# Altium project arm-radio.PrjPCB
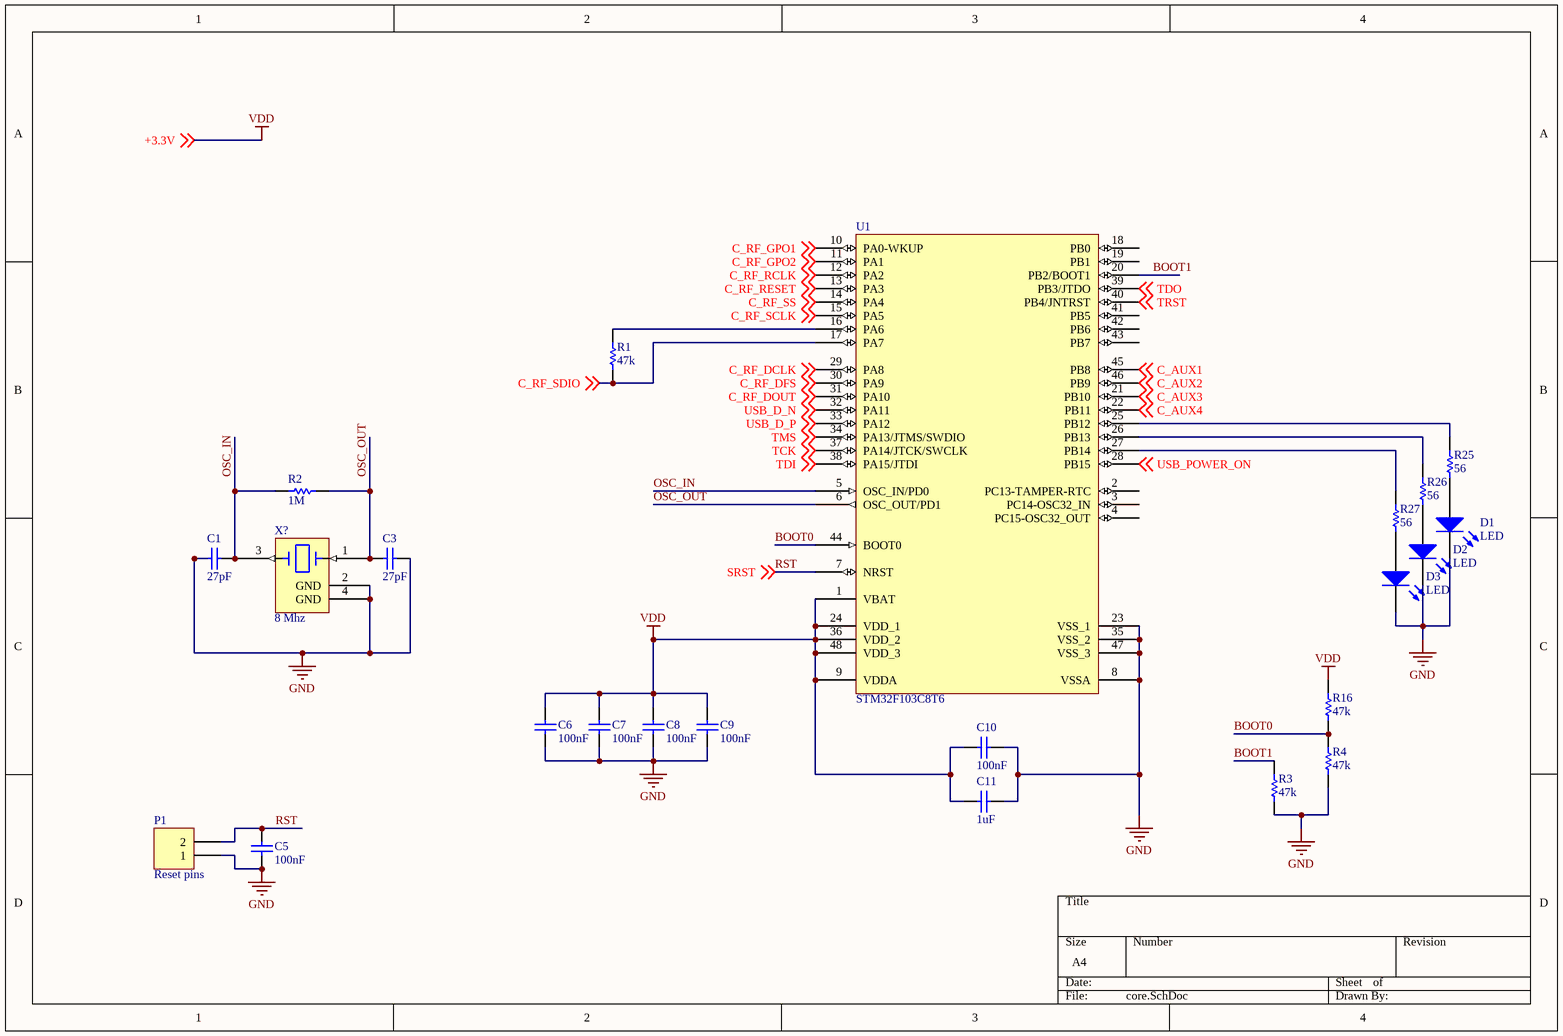
[diagram p0: core.SchDoc]
4 sheets, 54 parts. Net scope: global (net labels, ports and power ports of the same name join across sheets).
Board files: dummy.PcbDoc, dummy_planes.PcbDoc, dummy_planes_prod.PcbDoc, radio_v1.PcbDoc
Sheets:
  core.SchDoc
  usb_connector.SchDoc
  jtag_connector.SchDoc
  hole_field_direct.SchDoc

## Sheet core.SchDoc
size A4

### Parts
C1  27pF  [CHIP0402]
C3  27pF  [CHIP0402]
C5  100nF  [CHIP0402]
C6  100nF  [CHIP0402]
C7  100nF  [CHIP0402]
C8  100nF  [CHIP0402]
C9  100nF  [CHIP0402]
C10  100nF  [CHIP0402]
C11  1uF  [CHIP0402]
D1  LED  [LEDC2015X11L]
D2  LED  [LEDC2015X11L]
D3  LED  [LEDC2015X11L]
P1  Reset pins  [MHDR1X2]
R1  47k  [CHIP0402]
R2  1M  [CHIP0402]
R3  47k  [CHIP0402]
R4  47k  [CHIP0402]
R16  47k  [CHIP0402]
R25  56  [CHIP0402]
R26  56  [CHIP0402]
R27  56  [CHIP0402]
U1  STM32F103C8T6  [LQFP48_N]
X?  8 Mhz  [SMD0635x11mm]

### Nets
GND: C1.2 C3.1 C5.1 C6.1 C7.1 C8.1 C9.1 C10.2 C11.2 D1.2(K) D2.2(K) D3.2(K) P1.1 R3.1 R4.1 U1.8(VSSA) U1.23(VSS_1) U1.35(VSS_2) U1.47(VSS_3) X?.2(GND) X?.4(GND)
VDD: C6.2 C7.2 C8.2 C9.2 C10.1 C11.1 R16.2 U1.1(VBAT) U1.9(VDDA) U1.24(VDD_1) U1.36(VDD_2) U1.48(VDD_3) ; off-sheet +3.3V  [also labelled +3.3V]
BOOT0: R4.2 R16.1 U1.44(BOOT0)
BOOT1: R3.2 U1.20(PB2/BOOT1)
C_AUX1: U1.45(PB8) ; off-sheet C_AUX1
C_AUX2: U1.46(PB9) ; off-sheet C_AUX2
C_AUX3: U1.21(PB10) ; off-sheet C_AUX3
C_AUX4: U1.22(PB11) ; off-sheet C_AUX4
C_RF_DCLK: U1.29(PA8) ; off-sheet C_RF_DCLK
C_RF_DFS: U1.30(PA9) ; off-sheet C_RF_DFS
C_RF_DOUT: U1.31(PA10) ; off-sheet C_RF_DOUT
C_RF_GPO1: U1.10(PA0-WKUP) ; off-sheet C_RF_GPO1
C_RF_GPO2: U1.11(PA1) ; off-sheet C_RF_GPO2
C_RF_RCLK: U1.12(PA2) ; off-sheet C_RF_RCLK
C_RF_RESET: U1.13(PA3) ; off-sheet C_RF_RESET
C_RF_SCLK: U1.15(PA5) ; off-sheet C_RF_SCLK
C_RF_SDIO: R1.2 U1.17(PA7) ; off-sheet C_RF_SDIO
C_RF_SS: U1.14(PA4) ; off-sheet C_RF_SS
OSC_IN: C1.1 R2.2 U1.5(OSC_IN/PD0) X?.3
OSC_OUT: C3.2 R2.1 U1.6(OSC_OUT/PD1) X?.1
RST: C5.2 P1.2 U1.7(NRST) ; off-sheet SRST  [also labelled SRST]
TCK: U1.37(PA14/JTCK/SWCLK) ; off-sheet TCK
TDI: U1.38(PA15/JTDI) ; off-sheet TDI
TDO: U1.39(PB3/JTDO) ; off-sheet TDO
TMS: U1.34(PA13/JTMS/SWDIO) ; off-sheet TMS
TRST: U1.40(PB4/JNTRST) ; off-sheet TRST
USB_D_N: U1.32(PA11) ; off-sheet USB_D_N
USB_D_P: U1.33(PA12) ; off-sheet USB_D_P
USB_POWER_ON: U1.28(PB15) ; off-sheet USB_POWER_ON
NetD1_1: D1.1(A) R25.2
NetD2_1: D2.1(A) R26.1
NetD3_1: D3.1(A) R27.1
NetR1_1: R1.1 U1.16(PA6)
NetR25_1: R25.1 U1.25(PB12)
NetR26_2: R26.2 U1.26(PB13)
NetR27_2: R27.2 U1.27(PB14)

Not connected (* = marked no-connect by the designer): U1 2(PC13-TAMPER-RTC) 3(PC14-OSC32_IN) 4(PC15-OSC32_OUT) 18(PB0) 19(PB1) 41(PB5) 42(PB6) 43(PB7)

### Library data of the parts
C1 C3 C5-C11 = Cap: Capacitor; Published: 8-Jun-2000; LatestRevisionDate: 17-Jul-2002; LatestRevisionNote: Re-released for DXP Platform.; PackageReference: RAD-0.3; Publisher: Altium Limited; PackageDescription: Radial Cap, Thru-Hole; 2 Leads; 0.3 in Pin Spacing
  C1 C3: Value: 27pF
  C5-C10: Value: 100nF
  C11: Value: 1uF
D1-D3 = LED: Typical RED, GREEN, YELLOW, AMBER GaAs LED; Published: 8-Jun-2000; LatestRevisionDate: 17-Jul-2002; LatestRevisionNote: Re-released for DXP Platform.; PackageVersion: Feb-2002; PackageReference: 3.2X1.6X1.1; Publisher: Altium Limited; PackageDescription: SM LED; 2 Flat Leads
P1 = MHDR1X2: Header, 2-Pin; LatestRevisionDate: 17-Jul-2002; LatestRevisionNote: Re-released for DXP Platform.; Publisher: Altium Limited
R1-R4 R16 R25-R27 = Res1: Resistor; Published: 8-Jun-2000; LatestRevisionDate: 17-Jul-2002; LatestRevisionNote: Re-released for DXP Platform.; PackageReference: AXIAL-0.3; Publisher: Altium Limited; PackageDescription: Axial Device, Thru-Hole; 2 Leads; 0.3 in Pin Spacing
  R1 R3 R4 R16: Value: 47k
  R2: Value: 1M
  R25-R27: Value: 56
U1 = STM32F103C8T6: STM32 ARM-based 32-bit MCU with 64 Kbytes Flash, 48-pin LQFP, Industrial Temperature; Published: 30-May-2008; DatasheetVersion: rev6, Mar-2008; PackageVersion: Mar-2008; PackageReference: LQFP48; Publisher: Altium Limited; PackageDescription: 48-Pin Low-Profile Quad Flat Pack, 7 x 7 mm Body, 0.5 mm Pitch (LQFP48); ComponentLink1Description: Manufacturer Link; ComponentLink1URL: www.st.com/stm32; ComponentLink2Description: Datasheet; ComponentLink2URL: http://www.st.com/stonline/products/literature/ds/13587.pdf
X? = SMD4025-8.000: Crystal; Value: 8 Mhz

## Sheet usb_connector.SchDoc
size A4
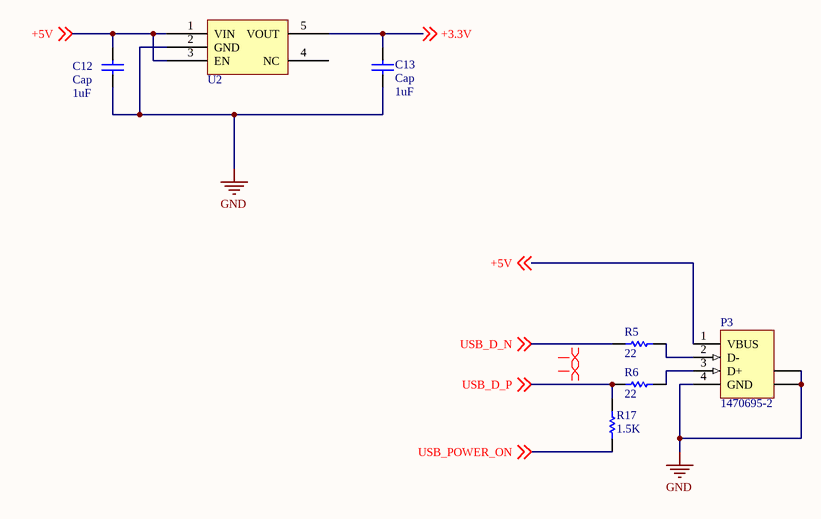
[diagram p1: usb_connector.SchDoc]

### Parts
C12  Cap  value 1uF  [CHIP0402]
C13  Cap  value 1uF  [CHIP0402]
P3  1470695-2  [1470695A]
R5  22  [CHIP0402]
R6  22  [CHIP0402]
R17  1.5K  [CHIP0402]
U2  ADP120  [SOT95P280X110-5L]  (value not drawn)

### Nets
+3.3V: C13.2 U2.5(VOUT) ; off-sheet +3.3V  [project net VDD]
GND: C12.1 C13.1 P3.4(GND) P3.5(SHLD) P3.6(SHLD) U2.2(GND)
+5V: C12.2 P3.1(VBUS) U2.1(VIN) U2.3(EN) ; off-sheet +5V
USB_D_N: R5.1 ; off-sheet USB_D_N
USB_D_P: R6.1 R17.1 ; off-sheet USB_D_P
USB_POWER_ON: R17.2 ; off-sheet USB_POWER_ON
NetP3_2: P3.2(D-) R5.2
NetP3_3: P3.3(D+) R6.2

Not connected (* = marked no-connect by the designer): U2 4(NC)

### Layout directives
differential pair: (no net found under the mark)

### Library data of the parts
C12 C13 = Cap: Capacitor; Published: 8-Jun-2000; LatestRevisionDate: 17-Jul-2002; LatestRevisionNote: Re-released for DXP Platform.; PackageReference: RAD-0.3; Publisher: Altium Limited; PackageDescription: Radial Cap, Thru-Hole; 2 Leads; 0.3 in Pin Spacing
P3 = 1470695-2: USB 1.1, Right Angle, SMT, A Type, Plug, 4 Position, Natural; ContactMaterial: Brass; ContactPlating: Gold (30) over Nickel (50); PCB_Layout: Complies with manufacturer's recommendation.; DrillSize: Corresponds to nominal value.; PanelGround: Without; Published: 15-Jul-2004; DatasheetDocument: 21-Jan-2003; PackageDocument: 21-Jan-2003; PackageReference: 1470695A; Publisher: Altium Limited; HousingMaterial: Thermoplastic; ComponentLink1Description: Manufacturer Link; ComponentLink1URL: http://www.tycoelectronics.com/; ComponentLink2Description: Packaging Specification; ComponentLink2URL: http://ecommas.tycoelectronics.com/commerce/DocumentDelivery/DDEController?Action=showdoc&DocId=Customer+Drawing%7F1470695%7FO%7Fpdf%7FEnglish%7FC_1470695_O.pdf
R5 R6 R17 = Res1: Resistor; Published: 8-Jun-2000; LatestRevisionDate: 17-Jul-2002; LatestRevisionNote: Re-released for DXP Platform.; PackageReference: AXIAL-0.3; Publisher: Altium Limited; PackageDescription: Axial Device, Thru-Hole; 2 Leads; 0.3 in Pin Spacing
  R5 R6: Value: 22
  R17: Value: 1.5K

## Sheet jtag_connector.SchDoc
size A4
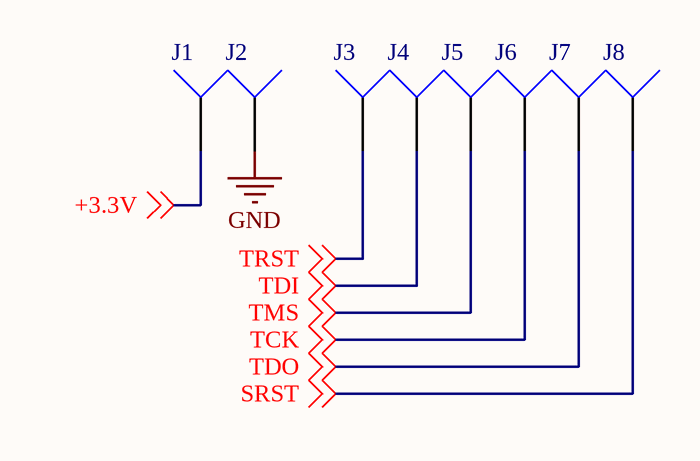
[diagram p2: jtag_connector.SchDoc]

### Parts
J1  Socket  [PIN1]  (value not drawn)
J2  Socket  [PIN1]  (value not drawn)
J3  Socket  [PIN1]  (value not drawn)
J4  Socket  [PIN1]  (value not drawn)
J5  Socket  [PIN1]  (value not drawn)
J6  Socket  [PIN1]  (value not drawn)
J7  Socket  [PIN1]  (value not drawn)
J8  Socket  [PIN1]  (value not drawn)

### Nets
+3.3V: J1.1 ; off-sheet +3.3V  [project net VDD]
GND: J2.1
SRST: J8.1 ; off-sheet SRST  [project net RST]
TCK: J6.1 ; off-sheet TCK
TDI: J4.1 ; off-sheet TDI
TDO: J7.1 ; off-sheet TDO
TMS: J5.1 ; off-sheet TMS
TRST: J3.1 ; off-sheet TRST

### Library data of the parts
J1-J8 = Socket: LatestRevisionDate: 17-Jul-2002; LatestRevisionNote: Re-released for DXP Platform.; Publisher: Altium Limited

## Sheet hole_field_direct.SchDoc
size A4
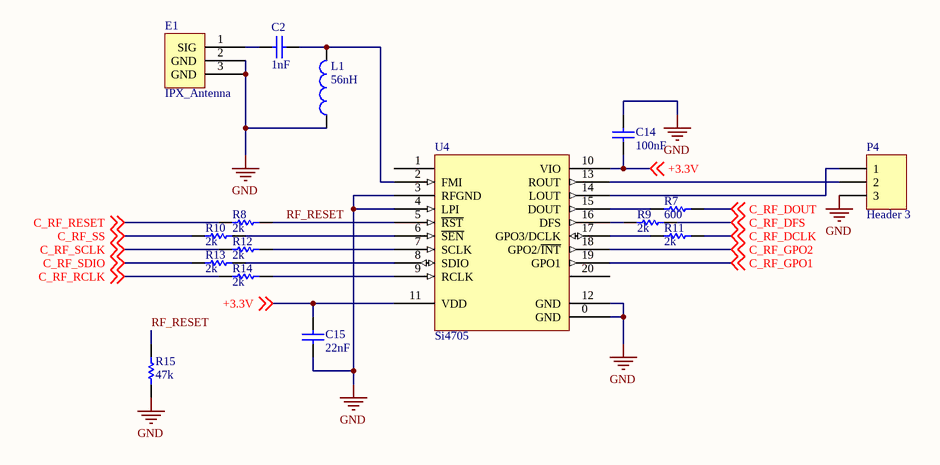
[diagram p3: hole_field_direct.SchDoc]

### Parts
C2  1nF  [CHIP0402]
C14  100nF  [CHIP0402]
C15  22nF  [CHIP0402]
E1  IPX_Antenna  [IPX-M]
L1  56nH  [0402-A]
P4  Header 3  [HDR1X3]
R7  600  [CHIP0402]
R8  2k  [CHIP0402]
R9  2k  [CHIP0402]
R10  2k  [CHIP0402]
R11  2k  [CHIP0402]
R12  2k  [CHIP0402]
R13  2k  [CHIP0402]
R14  2k  [CHIP0402]
R15  47k  [CHIP0402]
U4  Si4705  [QFN50P300X300X60-20N]

### Nets
+3.3V: C14.1 C15.2 U4.10(VIO) U4.11(VDD) ; off-sheet +3.3V  [project net VDD]
GND: C14.2 C15.1 E1.2(GND) E1.3(GND) L1.1 P4.3 R15.1 U4.0(GND) U4.3(RFGND) U4.4(LPI) U4.12(GND)
C_RF_DCLK: R11.2 ; off-sheet C_RF_DCLK
C_RF_DFS: R9.2 ; off-sheet C_RF_DFS
C_RF_DOUT: R7.2 ; off-sheet C_RF_DOUT
C_RF_GPO1: U4.19(GPO1) ; off-sheet C_RF_GPO1
C_RF_GPO2: U4.18(GPO2/~{INT}) ; off-sheet C_RF_GPO2
C_RF_RCLK: R14.1 ; off-sheet C_RF_RCLK
C_RF_RESET: R8.1 ; off-sheet C_RF_RESET
C_RF_SCLK: R12.1 ; off-sheet C_RF_SCLK
C_RF_SDIO: R13.1 ; off-sheet C_RF_SDIO
C_RF_SS: R10.1 ; off-sheet C_RF_SS
RF_RESET: R8.2 R15.2 U4.5(~{RST})
NetC2_1: C2.1 L1.2 U4.2(FMI)
NetC2_2: C2.2 E1.1(SIG)
NetP4_1: P4.1 U4.14(LOUT)
NetP4_2: P4.2 U4.13(ROUT)
NetR7_1: R7.1 U4.15(DOUT)
NetR9_1: R9.1 U4.16(DFS)
NetR10_2: R10.2 U4.6(~{SEN})
NetR11_1: R11.1 U4.17(GPO3/DCLK)
NetR12_2: R12.2 U4.7(SCLK)
NetR13_2: R13.2 U4.8(SDIO)
NetR14_2: R14.2 U4.9(RCLK)

Not connected (* = marked no-connect by the designer): U4 1(NC) 20(NC)

### Library data of the parts
C2 C14 C15 = Cap: Capacitor; Published: 8-Jun-2000; LatestRevisionDate: 17-Jul-2002; LatestRevisionNote: Re-released for DXP Platform.; PackageReference: RAD-0.3; Publisher: Altium Limited
  C2: Value: 1nF
  C14: Value: 100nF
  C15: Value: 22nF
L1 = Inductor: Code_IEC: 1005; Published: 8-Jun-2000; LatestRevisionDate: 29-May-2009; LatestRevisionNote: IPC-7351 Footprint Added.; PackageReference: 0402-A; Publisher: Altium Limited; PackageDescription: Chip Inductor; Code_JEITA: 0402; Value: 56nH
P4 = Header 3: Header, 3-Pin; LatestRevisionDate: 17-Jul-2002; LatestRevisionNote: Re-released for DXP Platform.; Publisher: Altium Limited
R7-R15 = Res1: Resistor; Published: 8-Jun-2000; LatestRevisionDate: 17-Jul-2002; LatestRevisionNote: Re-released for DXP Platform.; PackageReference: AXIAL-0.3; Publisher: Altium Limited
  R7: Value: 600
  R8-R14: Value: 2k
  R15: Value: 47k

## Nets that join several sheets
GND: core (21 pins), usb_connector (6 pins), jtag_connector (J2.1), hole_field_direct (11 pins)
VDD: core (12 pins), usb_connector (C13.2 U2.5), jtag_connector (J1.1), hole_field_direct (C14.1 C15.2 U4.10 U4.11)
C_RF_DCLK: core (U1.29), hole_field_direct (R11.2)
C_RF_DFS: core (U1.30), hole_field_direct (R9.2)
C_RF_DOUT: core (U1.31), hole_field_direct (R7.2)
C_RF_GPO1: core (U1.10), hole_field_direct (U4.19)
C_RF_GPO2: core (U1.11), hole_field_direct (U4.18)
C_RF_RCLK: core (U1.12), hole_field_direct (R14.1)
C_RF_RESET: core (U1.13), hole_field_direct (R8.1)
C_RF_SCLK: core (U1.15), hole_field_direct (R12.1)
C_RF_SDIO: core (R1.2 U1.17), hole_field_direct (R13.1)
C_RF_SS: core (U1.14), hole_field_direct (R10.1)
RST: core (C5.2 P1.2 U1.7), jtag_connector (J8.1)
TCK: core (U1.37), jtag_connector (J6.1)
TDI: core (U1.38), jtag_connector (J4.1)
TDO: core (U1.39), jtag_connector (J7.1)
TMS: core (U1.34), jtag_connector (J5.1)
TRST: core (U1.40), jtag_connector (J3.1)
USB_D_N: core (U1.32), usb_connector (R5.1)
USB_D_P: core (U1.33), usb_connector (R6.1 R17.1)
USB_POWER_ON: core (U1.28), usb_connector (R17.2)

## Assembly variants
BootApplication: not fitted R16